# EAGLE design RX_test (EAGLE 9.5.0)
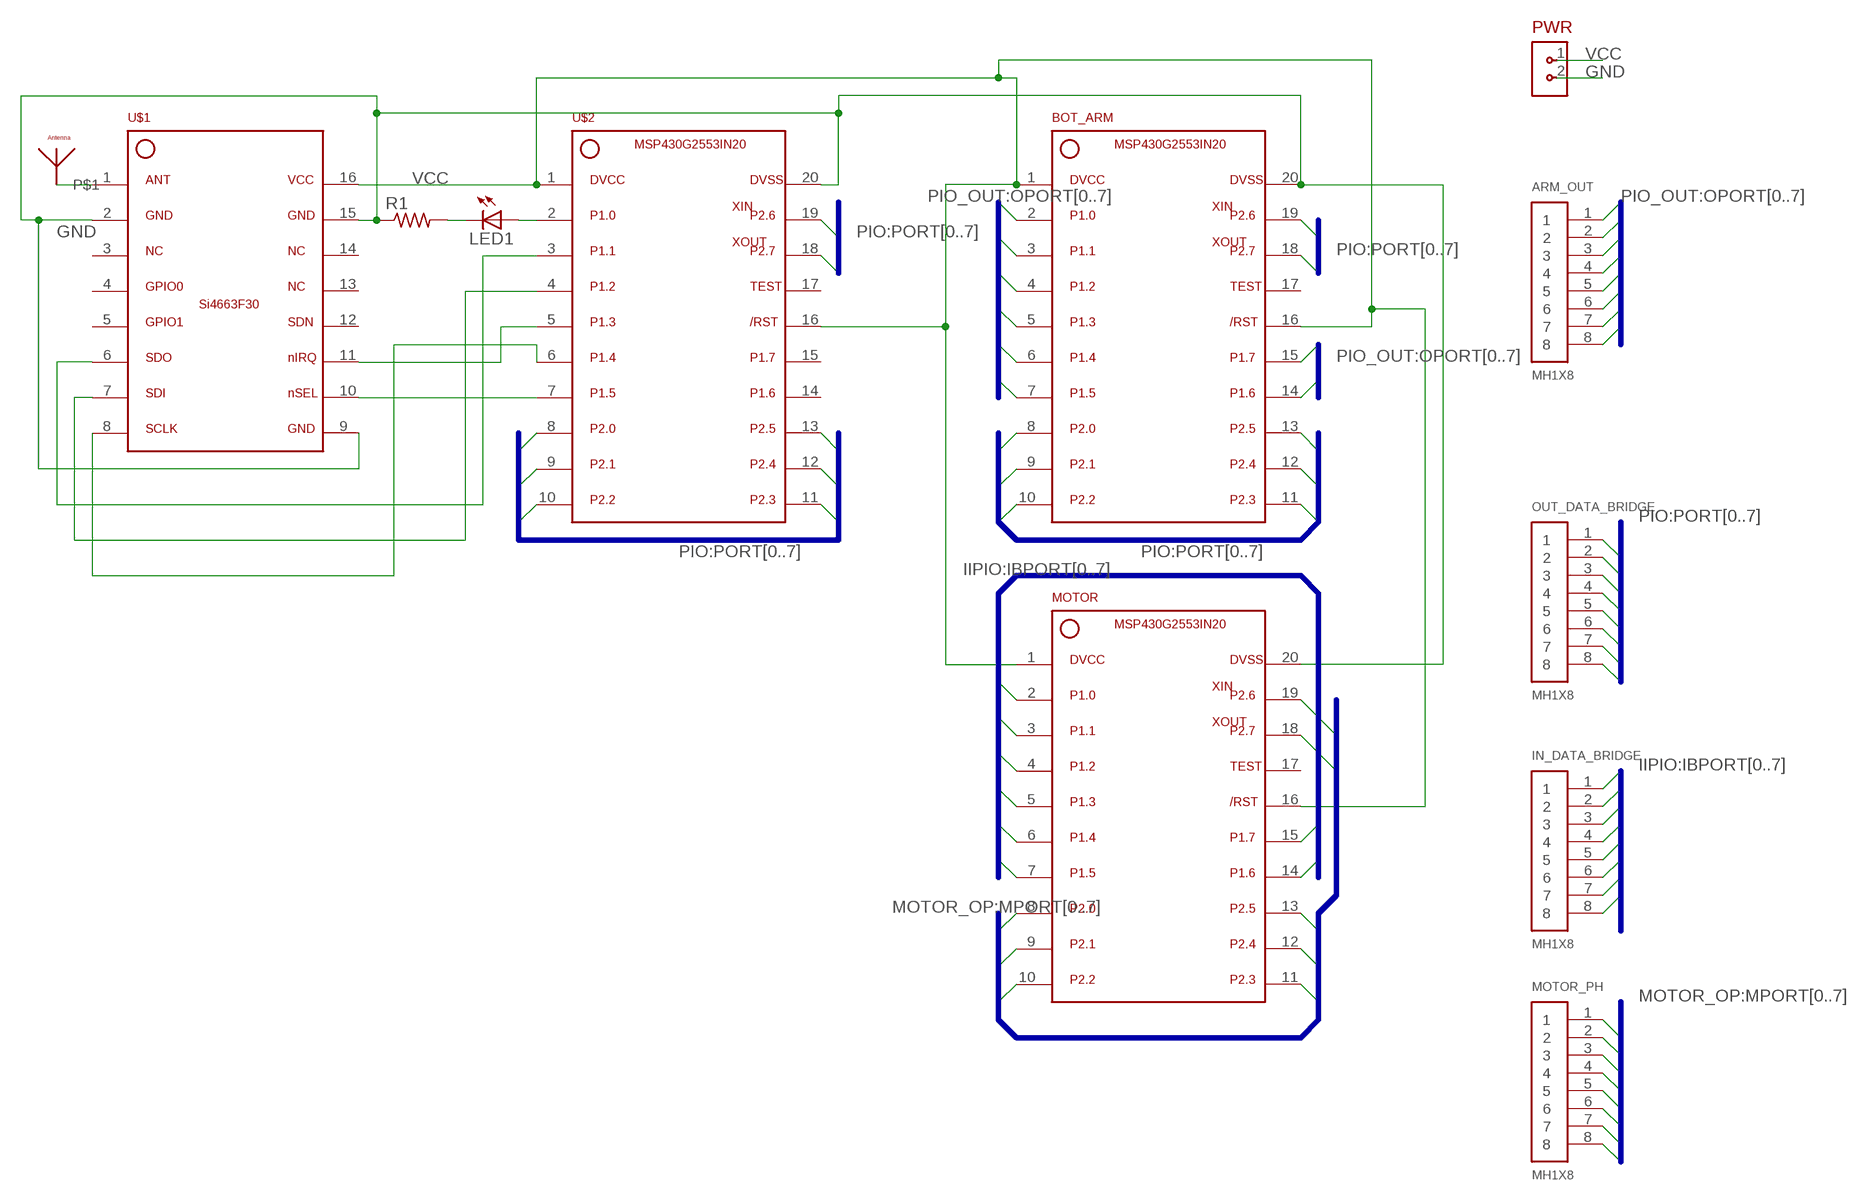
[diagram p0: schematic, sheet 1]

## Parts
ARM_OUT  MH1X8  [61300811121]
BOT_ARM  MSP430G2553IN20  [DIP762W53P254L2215H508Q20B]
IN_DATA_BRIDGE  MH1X8  [61300811121]
LED1  LED3MM  [LED3MM]
MOTOR  MSP430G2553IN20  [DIP762W53P254L2215H508Q20B]
MOTOR_PH  MH1X8  [61300811121]
OUT_DATA_BRIDGE  MH1X8  [61300811121]
PWR  FH1X2  [HDRVR2W64P254_1X2_1016X508X254B]
R1  R-US_0204/7  [0204/7]
U$1  SI4663F30SI4663F30-3D  [INDCAV400P3800X2000X400-16N]
U$2  MSP430G2553IN20  [DIP762W53P254L2215H508Q20B]
U$4  ANTENNA  [ANTENNA]

## Nets
GND: BOT_ARM.20 MOTOR.20 PWR.2 R1.1 U$1.2 U$1.9 U$1.15 U$2.20
IBPORT0: IN_DATA_BRIDGE.1 MOTOR.2
IBPORT1: IN_DATA_BRIDGE.2 MOTOR.3
IBPORT2: IN_DATA_BRIDGE.3 MOTOR.4
IBPORT3: IN_DATA_BRIDGE.4 MOTOR.5
IBPORT4: IN_DATA_BRIDGE.5 MOTOR.6
IBPORT5: IN_DATA_BRIDGE.6 MOTOR.7
IBPORT6: IN_DATA_BRIDGE.7 MOTOR.14
IBPORT7: IN_DATA_BRIDGE.8 MOTOR.15
MPORT0: MOTOR.8 MOTOR_PH.1
MPORT1: MOTOR.9 MOTOR_PH.2
MPORT2: MOTOR.10 MOTOR_PH.3
MPORT3: MOTOR.11 MOTOR_PH.4
MPORT4: MOTOR.12 MOTOR_PH.5
MPORT5: MOTOR.13 MOTOR_PH.6
MPORT6: MOTOR.19 MOTOR_PH.7
MPORT7: MOTOR.18 MOTOR_PH.8
N$2: LED1.K(C) R1.2
N$3: LED1.A U$2.2
N$5: U$1.1 U$4.P$1
N$6: U$1.6 U$2.3
N$7: U$1.7 U$2.4
N$8: U$1.8 U$2.6
N$10: U$1.10 U$2.7
N$11: U$1.11 U$2.5
OPORT0: ARM_OUT.1 BOT_ARM.2
OPORT1: ARM_OUT.2 BOT_ARM.3
OPORT2: ARM_OUT.3 BOT_ARM.4
OPORT3: ARM_OUT.4 BOT_ARM.5
OPORT4: ARM_OUT.5 BOT_ARM.6
OPORT5: ARM_OUT.6 BOT_ARM.7
OPORT6: ARM_OUT.7 BOT_ARM.14
OPORT7: ARM_OUT.8 BOT_ARM.15
PORT0: BOT_ARM.8 OUT_DATA_BRIDGE.1 U$2.8
PORT1: BOT_ARM.9 OUT_DATA_BRIDGE.2 U$2.9
PORT2: BOT_ARM.10 OUT_DATA_BRIDGE.3 U$2.10
PORT3: BOT_ARM.11 OUT_DATA_BRIDGE.4 U$2.11
PORT4: BOT_ARM.12 OUT_DATA_BRIDGE.5 U$2.12
PORT5: BOT_ARM.13 OUT_DATA_BRIDGE.6 U$2.13
PORT6: BOT_ARM.19 OUT_DATA_BRIDGE.7 U$2.19
PORT7: BOT_ARM.18 OUT_DATA_BRIDGE.8 U$2.18
VCC: BOT_ARM.1 BOT_ARM.16 MOTOR.1 MOTOR.16 PWR.1 U$1.16 U$2.1 U$2.16
Unconnected: BOT_ARM.17 MOTOR.17 U$1.3 U$1.4 U$1.5 U$1.12 U$1.13 U$1.14 U$2.14 U$2.15 U$2.17

## Buses
PIO:PORT[0..7]
PIO_OUT:OPORT[0..7]
IIPIO:IBPORT[0..7]
MOTOR_OP:MPORT[0..7]

## Library data of the parts
ARM_OUT IN_DATA_BRIDGE MOTOR_PH OUT_DATA_BRIDGE = Phase_2:MH1X8: CONN HEADER VERT 8POS 2.54MM Manufacturer's datasheet <https://katalog.we-online.de/em/datasheet/6130xx11121.pdf>; CREATED_BY: PCBLayout.com; DIGI_KEY_PART_NUMBER: 732-5321-ND; MANUFACTURER: Wurth Electronics Inc.; MPN: 61300811121
BOT_ARM MOTOR U$2 = Phase_2:MSP430G2553IN20
LED1 = Phase_2:LED: LED OSRAM: - CHIPLED LG R971, LG N971, LY N971, LG Q971, LY Q971, LO R971, LY R971 LH N974, LH R974 LS Q976, LO Q976, LY Q976 LO Q996 - Hyper CHIPLED LW Q18S LB Q993, LB Q99A, LB R99A - SideLED LS A670, LO A670, LY A670, LG A670, LP A670 LB A673, LV A673, LT A673, LW A673 LH A674 LY A675 LS A676, LA A676, LO A676, LY A676, LW A676 LS A679, LY A679, LG A679 - Hyper Micro SIDELED® LS Y876, LA Y876, LO Y876, LY Y876 LT Y87S - SmartLED LW L88C, LW L88S LB L89C, LB L89S, LG L890 LS L89K, LO L89K, LY L89K LS L896, LA L896, LO L896, LY L896 - TOPLED LS T670, LO T670, LY T670, LG T670, LP T670 LSG T670, LSP T670, LSY T670, LOP T670, LYG T670 LG T671, LOG T671, LSG T671 LB T673, LV T673, LT T673, LW T673 LH T674 LS T676, LA T676, LO T676, LY T676, LB T676, LH T676, LSB T676, LW T676 LB T67C, LV T67C, LT T67C, LS T67K, LO T67K, LY T67K, LW E67C LS E67B, LA E67B, LO E67B, LY E67B, LB E67C, LV E67C, LT E67C LW T67C LS T679, LY T679, LG T679 LS T770, LO T770, LY T770, LG T770, LP T770 LB T773, LV T773, LT T773, LW T773 LH T774 LS E675, LA E675, LY E675, LS T675 LS T776, LA T776, LO T776, LY T776, LB T776 LHGB T686 LT T68C, LB T68C - Hyper Mini TOPLED® LB M676 - Mini TOPLED Santana® LG M470 LS M47K, LO M47K, LY M47K Source: http://www.osram.convergy.de/
PWR = Phase_2:FH1X2
R1 = Phase_2:R-US_: RESISTOR, American symbol
U$1 = Phase_2:SI4663F30: 1W Long Range RF Module from NiceRF. Si4663F30
U$4 = Phase_2:ANTENNA

## Board
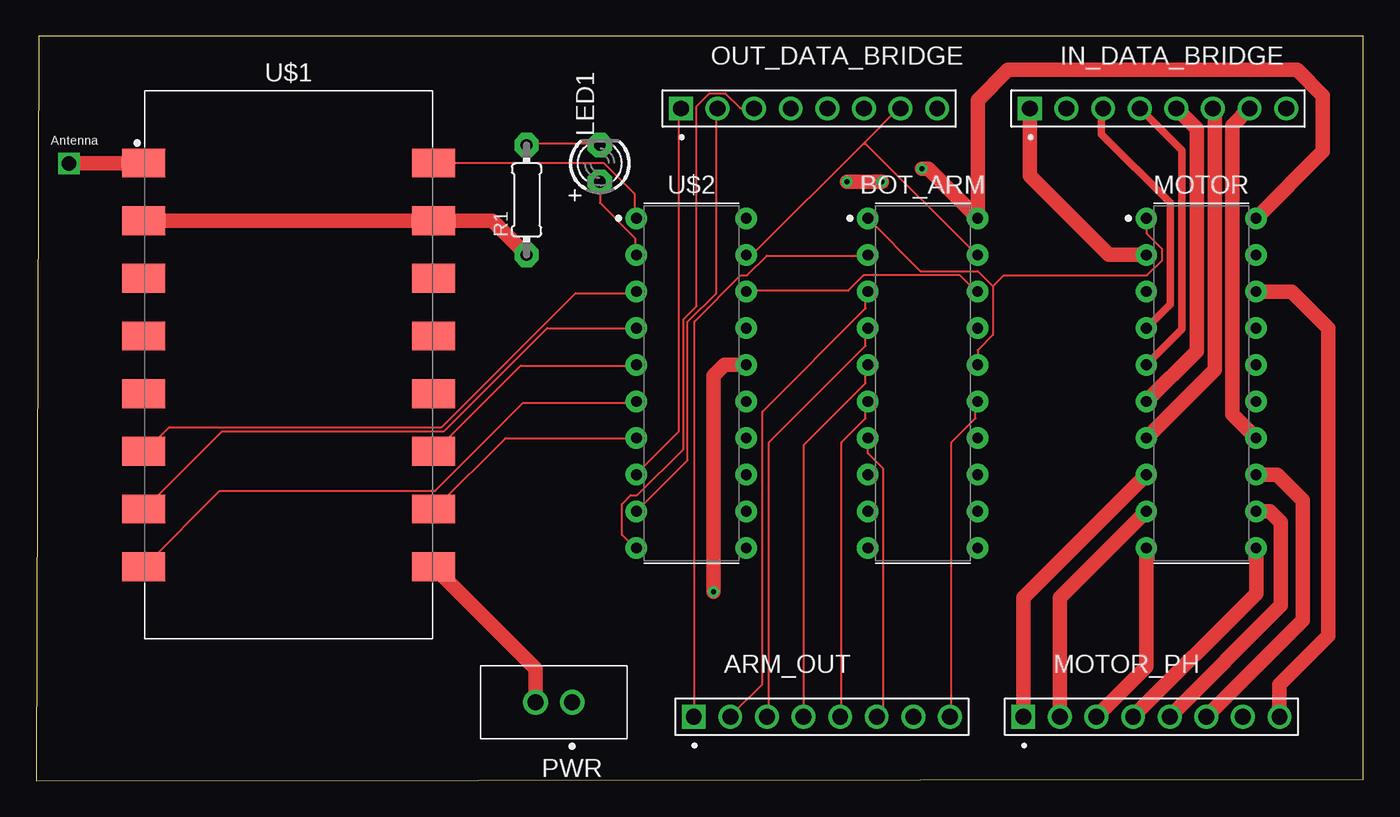
[diagram p1: board, top side]
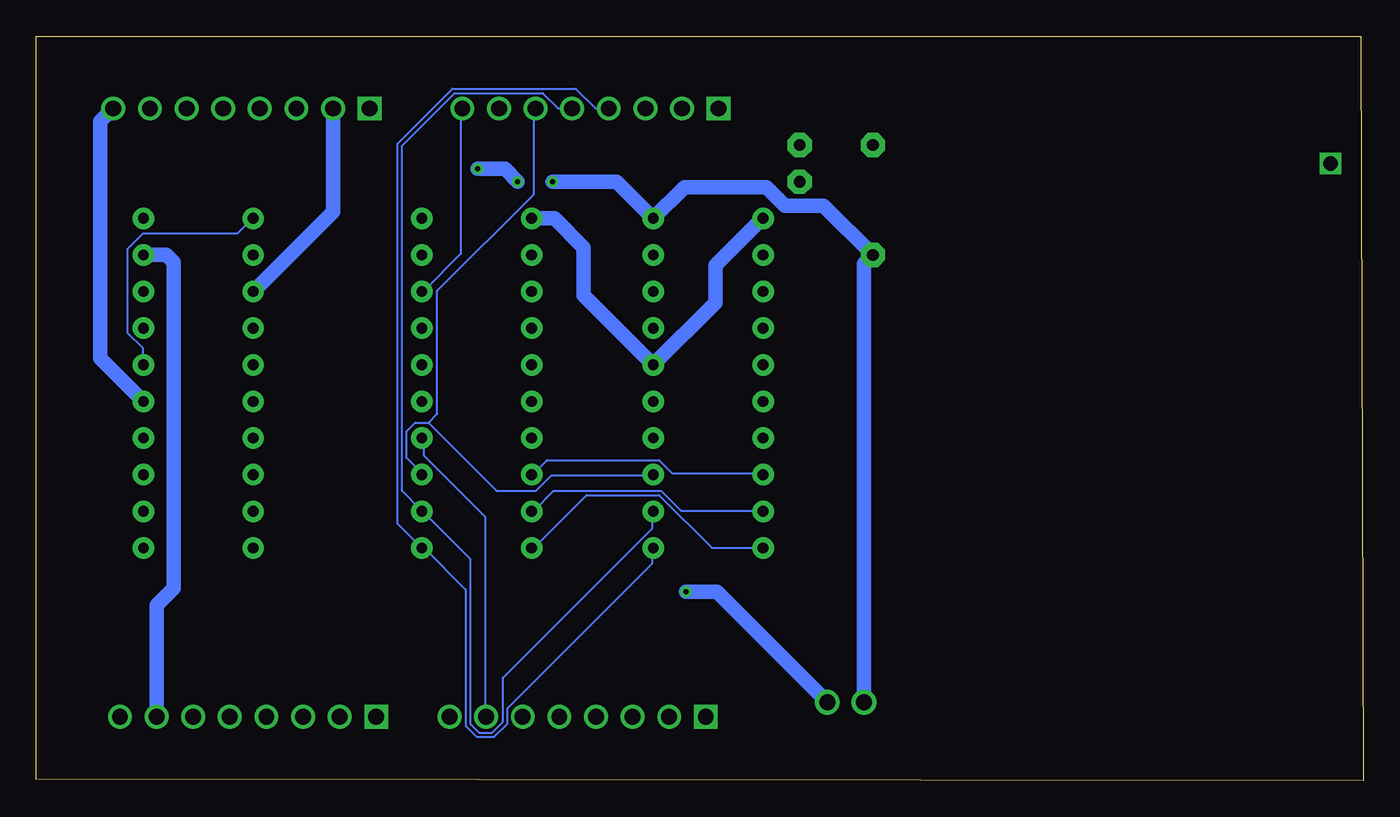
[diagram p2: board, bottom side, seen from below]

Size 92.09 x 51.63 mm. Coordinates in mm from the lower left corner, seen from the top.
Outline: 0,0 92.09,0.08 92.09,51.63 0.2,51.63 0,0
Copper layers (1*16): Top 0.035mm / dielectric 1.5mm / Bottom 0.035mm
Design rules "default": minimum track width 6mil, minimum drill 0.35mm, track to track 6mil, track to pad 6mil, pad to pad 6mil, via to via 6mil, smd to smd 6mil, copper to edge 40mil, drill to drill 6mil, minimum pad ring 10mil, minimum via ring 8mil, stop-mask expansion 4mil, vias tented up to drill 0mil, thermal gap 10mil

### Footprints (pad centres in the part's own frame; a part is rotated, then mirrored left to right if it is on the bottom)
61300811121 = drill 1.1 square: 1 -8.89,0 | drill 1.1: 2 -6.35,0; 3 -3.81,0; 4 -1.27,0; 5 1.27,0; 6 3.81,0; 7 6.35,0; 8 8.89,0
DIP762W53P254L2215H508Q20B = drill 0.743 pad 1.487: 1 -3.81,11.43; 2 -3.81,8.89; 3 -3.81,6.35; 4 -3.81,3.81; 5 -3.81,1.27; 6 -3.81,-1.27; 7 -3.81,-3.81; 8 -3.81,-6.35; 9 -3.81,-8.89; 10 -3.81,-11.43; 11 3.81,-11.43; 12 3.81,-8.89; 13 3.81,-6.35; 14 3.81,-3.81; 15 3.81,-1.27; 16 3.81,1.27; 17 3.81,3.81; 18 3.81,6.35; 19 3.81,8.89; 20 3.81,11.43
LED3MM = drill 0.813 pad 1.676 octagon: A -1.27,0; K 1.27,0
HDRVR2W64P254_1X2_1016X508X254B = drill 1.105 pad 1.705: 1 0,0; 2 2.54,0
0204/7 = drill 0.813 pad 1.676 octagon: 1 -3.81,0; 2 3.81,0
INDCAV400P3800X2000X400-16N = smd 3 x 2: 1 -10.06,14; 2 -10.06,10; 3 -10.06,6; 4 -10.06,2; 5 -10.06,-2; 6 -10.06,-6; 7 -10.06,-10; 8 -10.06,-14; 9 10.06,-14; 10 10.06,-10; 11 10.06,-6; 12 10.06,-2; 13 10.06,2; 14 10.06,6; 15 10.06,10; 16 10.06,14
ANTENNA = drill 1 square: P$1 0,0

### Placement (x,y rotation side)
ARM_OUT  54.51,4.43 0 top
BOT_ARM  61.51,27.56 0 top
IN_DATA_BRIDGE  77.83,46.61 0 top
LED1  39.11,42.8 90 top
MOTOR  80.83,27.56 0 top
MOTOR_PH  77.37,4.43 0 top
OUT_DATA_BRIDGE  53.62,46.61 0 top
PWR  37.19,5.43 180 top
R1  34.03,40.26 90 top
U$1  17.52,28.83 0 top
U$2  45.46,27.56 0 top
U$4  2.28,42.8 0 top

### Tracks (layer width: path | path; a pad name or v marks a point on that pad's centre or on a via)
GND  (via drill 0.35)
  Top 0.152: 7.57,38.83 U$1.2 | 27.53,38.83 U$1.15 27.68,38.68 | 27.68,14.75 U$1.9 | 34.54,5.46 PWR.2 | 65.17,42.34 65.17,38.99 BOT_ARM.20
  Top 1.016: U$1.2 27.54,38.83 | 27.54,38.83 27.68,38.68 | R1.1 31.65,38.83 27.54,38.83 | U$1.9 34.65,7.76 PWR.2 | MOTOR.20 89.28,43.62 89.28,47.5 87.5,49.27 67.43,49.27 65.32,47.16 BOT_ARM.20 61.89,42.42 v61.47,42.42 | v58.67,41.53 v56.26,41.53
  Bottom 0.152: 34.08,36.55 R1.1 34.54,35.94
  Bottom 1.016: PWR.2 34.65,35.83 R1.1 37.46,39.88 40.13,39.88 41.4,41.15 47.11,41.15 U$2.20 51.81,41.53 v56.26,41.53 | v61.47,42.42 59.56,42.42 v58.67,41.53
IBPORT0
  Top 1.016: IN_DATA_BRIDGE.1 68.94,41.92 74.42,36.45 MOTOR.2
IBPORT1
  Bottom 1.016: MOTOR.3 71.48,39.45 IN_DATA_BRIDGE.2
IBPORT2
  Top 0.508: MOTOR.4 78.69,33.03 78.69,40.05 73.91,44.83 73.91,46.49 IN_DATA_BRIDGE.3
IBPORT3
  Top 0.508: MOTOR.5 79.47,31.28 79.47,43.7 IN_DATA_BRIDGE.4
IBPORT4
  Top 1.016: MOTOR.6 80.52,29.78 80.52,45.19 IN_DATA_BRIDGE.5
IBPORT5
  Top 1.016: MOTOR.7 81.77,28.49 81.77,46.48 IN_DATA_BRIDGE.6
IBPORT6
  Top 1.016: MOTOR.14 82.99,25.4 82.99,45.41 IN_DATA_BRIDGE.7
IBPORT7
  Bottom 1.016: MOTOR.15 87.63,29.27 87.63,45.7 IN_DATA_BRIDGE.8
MPORT0
  Top 1.016: MOTOR_PH.1 68.48,12.67 MOTOR.8
MPORT1
  Top 1.016: MOTOR_PH.2 71.02,12.67 MOTOR.9
MPORT2
  Top 1.016: MOTOR.10 77.02,7.89 MOTOR_PH.3
MPORT3
  Top 1.016: MOTOR_PH.4 84.64,12.97 MOTOR.11
MPORT4
  Top 1.016: MOTOR_PH.5 86.36,12.14 86.36,17.9 85.6,18.67 MOTOR.12
MPORT5
  Top 1.016: MOTOR_PH.6 87.88,11.12 87.88,19.43 86.1,21.21 MOTOR.13
MPORT6
  Bottom 1.016: MOTOR_PH.7 83.72,12.16 82.55,13.33 82.55,35.94 83.06,36.45 MOTOR.19
MPORT7
  Top 1.016: MOTOR_PH.8 86.26,6.63 89.66,10.03 89.66,31.37 87.12,33.91 MOTOR.18
N$2
  Top 0.152: R1.2 34.08,44.17 39.11,44.17 LED1.K
N$3
  Top 0.152: LED1.A 39.11,40.05 41.55,37.61 41.55,36.55 U$2.2
N$5
  Top 0.152: 7.41,42.8 U$1.1
  Top 1.016: U$4.P$1 7.43,42.8 U$1.1
N$6
  Top 0.152: U$2.3 41.55,33.8 37.44,33.8 28.14,24.51 9.24,24.51 7.57,22.83 U$1.6
N$7
  Top 0.152: U$2.4 35.46,31.37 28.29,24.2 12.9,24.2 7.57,18.87 U$1.7
N$8
  Top 0.152: U$2.6 41.55,26.18 33.78,26.18 27.68,20.09 12.75,20.09 7.57,14.91 U$1.8
N$10
  Top 0.152: U$2.7 32.56,23.75 27.68,18.87 U$1.10
N$11
  Top 0.152: U$2.5 41.55,28.78 33.63,28.78 27.68,22.83 U$1.11
OPORT0
  Top 0.152: BOT_ARM.2 57.55,36.4 50.7,36.4 49.32,35.02 48.87,35.02 45.67,31.82 45.67,4.54 ARM_OUT.1
OPORT1
  Top 0.152: BOT_ARM.3 57.55,33.8 57.55,32.74 50.39,25.58 50.39,6.68 48.26,4.54 ARM_OUT.2
OPORT2
  Top 0.152: BOT_ARM.4 57.55,31.37 57.55,30.15 50.85,23.44 50.85,4.54 ARM_OUT.3
OPORT3
  Top 0.152: BOT_ARM.5 57.55,28.78 57.55,27.56 53.29,23.29 53.29,4.54 ARM_OUT.4
OPORT4
  Top 0.152: BOT_ARM.6 57.55,26.18 57.55,25.12 55.88,23.44 55.88,4.54 ARM_OUT.5
OPORT5
  Top 0.152: BOT_ARM.7 57.71,22.68 58.77,21.61 58.77,4.85 58.47,4.54 ARM_OUT.6
OPORT6
  Bottom 0.152: BOT_ARM.14 65.17,23.75 65.17,22.53 60.91,18.26 60.91,4.54 ARM_OUT.7
OPORT7
  Top 0.152: BOT_ARM.15 65.17,26.18 65.17,25.12 63.5,23.44 63.5,4.54 ARM_OUT.8
PORT0
  Top 0.152: OUT_DATA_BRIDGE.1 44.6,46.61 44.6,24.2 41.7,21.31 U$2.8
  Bottom 0.152: U$2.8 41.7,21.31 47.95,21.31 48.87,22.22 56.64,22.22 57.55,21.31 BOT_ARM.8
PORT1
  Top 0.152: U$2.9 45.21,22.22 45.21,31.82 47.19,33.8 47.19,46.61 OUT_DATA_BRIDGE.2
  Bottom 0.152: U$2.9 41.7,18.72 47.34,18.72 48.71,20.09 56.18,20.09 57.55,18.72 BOT_ARM.9
PORT2
  Top 0.152: OUT_DATA_BRIDGE.3 48.87,46.61 47.8,47.67 46.73,47.67 45.82,46.76 45.82,32.89 44.9,31.98 44.9,22.98 41.7,19.78 41.25,19.78 40.64,19.17 40.64,17.04 41.55,16.13 U$2.10
  Bottom 0.152: U$2.10 45.21,16.13 48.87,19.78 53.9,19.78 57.55,16.13 BOT_ARM.10
PORT3
  Bottom 0.152: U$2.11 49.32,16.13 49.32,15.06 59.38,5 59.38,3.93 60.3,3.02 61.52,3.02 62.28,3.78 62.28,13.23 65.17,16.13 BOT_ARM.11 67,17.8 67,44.17 63.19,47.98 54.66,47.98 53.29,46.61 OUT_DATA_BRIDGE.4
PORT4
  Bottom 0.152: U$2.12 49.32,18.56 49.32,17.5 59.69,7.13 59.69,4.09 60.45,3.32 61.36,3.32 61.97,3.93 61.97,15.36 65.17,18.56 BOT_ARM.12 65.33,18.72 66.7,20.09 66.7,44.02 63.04,47.67 56.94,47.67 55.88,46.61 OUT_DATA_BRIDGE.5
PORT5
  Bottom 0.152: 64.87,24.81 60.14,20.09 57.4,20.09 56.33,21.16 49.32,21.16 U$2.13 | 64.87,24.81 65.78,24.81 66.39,24.2 66.39,22.37 65.33,21.31 BOT_ARM.13 | 64.87,24.81 64.26,25.42 64.26,33.96 57.55,40.66 57.55,46.61 OUT_DATA_BRIDGE.6
PORT6
  Top 0.152: 57.4,44.17 59.84,46.61 OUT_DATA_BRIDGE.7 | 57.4,44.17 49.78,36.55 49.32,36.55 U$2.19 | 57.4,44.17 57.55,44.17 65.17,36.55 BOT_ARM.19
PORT7
  Top 0.152: U$2.18 49.32,33.96 56.33,33.96 57.4,35.02 64.11,35.02 65.17,33.96 BOT_ARM.18
  Bottom 0.152: OUT_DATA_BRIDGE.8 62.58,46.61 62.58,36.55 65.17,33.96 BOT_ARM.18
VCC  (via drill 0.35)
  Top 0.152: 66.39,34.26 66.39,30.91 65.33,29.84 65.33,28.93 BOT_ARM.16 | 66.39,34.26 65.33,35.33 61.36,35.33 BOT_ARM.1 | 66.39,34.26 67.16,35.02 77.06,35.02 78.13,36.09 78.13,36.85 77.06,37.92 77.06,38.99 MOTOR.1 | U$1.16 27.68,42.8 39.42,42.8 41.55,40.66 41.55,38.99 U$2.1
  Top 1.016: v46.99,13.08 46.99,28.06 47.75,28.83 U$2.16
  Bottom 0.152: 49.17,28.93 U$2.16 49.17,28.78 | 41.7,38.99 U$2.1 | MOTOR.16 84.68,28.93 84.68,29.99 85.75,31.06 85.75,36.85 84.68,37.92 78.13,37.92 77.06,38.99 MOTOR.1 | 37.28,5.46 PWR.1
  Bottom 1.016: PWR.1 44.85,13.08 v46.99,13.08 | 41.7,38.99 44.96,35.74 44.96,33.14 U$2.16 54.1,33.65 54.1,36.95 56.13,38.99 BOT_ARM.1